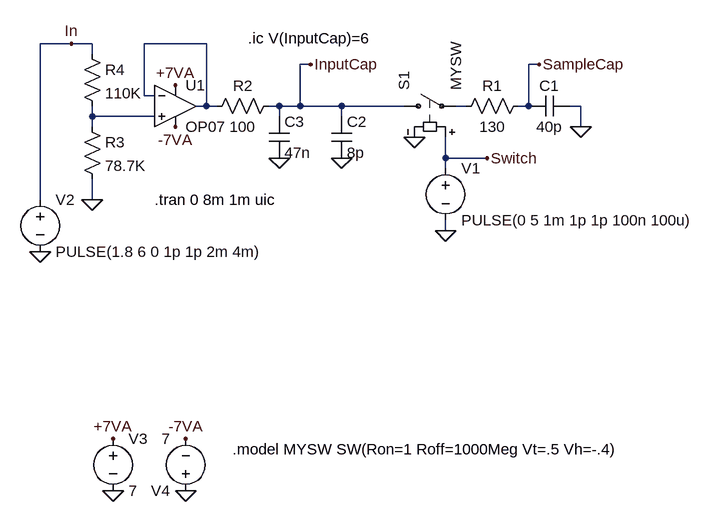
[diagram p0: schematic ADCInputSYM_withAMP2.asc]
ADCInputSYM_withAMP2.asc, the LTspice schematic file:
Version 4
SHEET 1 880 804
WIRE -368 96 -416 96
WIRE -336 96 -368 96
WIRE -160 96 -256 96
WIRE -336 112 -336 96
WIRE 0 128 -16 128
WIRE 352 128 336 128
WIRE -256 176 -256 96
WIRE -240 176 -256 176
WIRE -160 192 -160 96
WIRE -160 192 -176 192
WIRE -144 192 -160 192
WIRE -48 192 -64 192
WIRE -16 192 -16 128
WIRE -16 192 -48 192
WIRE 48 192 -16 192
WIRE 144 192 48 192
WIRE 240 192 224 192
WIRE 336 192 336 128
WIRE 336 192 320 192
WIRE 416 192 400 192
WIRE -336 208 -336 192
WIRE -240 208 -336 208
WIRE -48 208 -48 192
WIRE 48 208 48 192
WIRE -336 224 -336 208
WIRE 416 224 416 192
WIRE 208 272 208 240
WIRE 272 272 208 272
WIRE 208 288 208 272
WIRE -416 336 -416 96
WIRE -336 336 -336 304
WIRE 208 384 208 368
FLAG 48 272 0
FLAG -48 272 0
FLAG 160 240 0
FLAG 208 384 0
FLAG 416 224 0
FLAG -336 336 0
FLAG -416 416 0
FLAG 0 128 InputCap
FLAG -304 784 0
FLAG -192 784 0
FLAG 272 272 Switch
FLAG 352 128 SampleCap
FLAG -304 704 +7VA
FLAG -208 160 +7VA
FLAG -192 704 -7VA
FLAG -208 224 -7VA
FLAG -368 96 In
SYMBOL res 336 176 R90
WINDOW 0 0 56 VBottom 2
WINDOW 3 32 56 VTop 2
SYMATTR InstName R1
SYMATTR Value 130
SYMBOL cap 400 176 R90
WINDOW 0 0 32 VBottom 2
WINDOW 3 32 32 VTop 2
SYMATTR InstName C1
SYMATTR Value 40p
SYMBOL sw 128 192 R270
SYMATTR InstName S1
SYMATTR Value MYSW
SYMBOL cap 32 208 R0
SYMATTR InstName C2
SYMATTR Value 8p
SYMBOL cap -64 208 R0
SYMATTR InstName C3
SYMATTR Value 47n
SYMBOL res -48 176 R90
WINDOW 0 0 56 VBottom 2
WINDOW 3 32 56 VTop 2
SYMATTR InstName R2
SYMATTR Value 100
SYMBOL res -352 208 R0
SYMATTR InstName R3
SYMATTR Value 78.7K
SYMBOL res -352 96 R0
SYMATTR InstName R4
SYMATTR Value 110K
SYMBOL voltage 208 272 R0
WINDOW 123 0 0 Left 2
WINDOW 39 0 0 Left 2
SYMATTR InstName V1
SYMATTR Value PULSE(0 5 1m 1p 1p 100n 100u)
SYMBOL voltage -416 320 R0
WINDOW 123 0 0 Left 2
WINDOW 39 0 0 Left 2
SYMATTR InstName V2
SYMATTR Value PULSE(1.8 6 0 1p 1p 2m 4m)
SYMBOL Opamps\\OP07 -208 128 R0
SYMATTR InstName U1
SYMBOL voltage -304 688 R0
WINDOW 123 0 0 Left 2
WINDOW 39 0 0 Left 2
SYMATTR InstName V3
SYMATTR Value 7
SYMBOL voltage -192 800 R180
WINDOW 123 0 0 Left 2
WINDOW 39 0 0 Left 2
SYMATTR InstName V4
SYMATTR Value 7
TEXT -240 336 Left 2 !.tran 0 8m 1m uic
TEXT -120 720 Left 2 !.model MYSW SW(Ron=1 Roff=1000Meg Vt=.5 Vh=-.4)
TEXT -96 88 Left 2 !.ic V(InputCap)=6

The netlist it stands for:
* ADCInputSYM_withAMP2.asc
R1 SampleCap N002 130
C1 0 SampleCap 40p
S1 InputCap N002 Switch 0 MYSW
C2 InputCap 0 8p
C3 InputCap 0 47n
R2 InputCap N001 100
R3 N003 0 78.7K
R4 In N003 110K
V1 Switch 0 PULSE(0 5 1m 1p 1p 100n 100u)
V2 In 0 PULSE(1.8 6 0 1p 1p 2m 4m)
XU1 N003 N001 +7VA -7VA N001 LT1001  ; OP07, pins In+ In- V+ V- OUT
V3 +7VA 0 7
V4 0 -7VA 7
.tran 0 8m 1m uic
.model MYSW SW(Ron=1 Roff=1000Meg Vt=.5 Vh=-.4)
.ic V(InputCap)=6
.lib LTC.lib
.backanno
.end

* Results of the author's LTspice run, read from the files saved beside the schematic
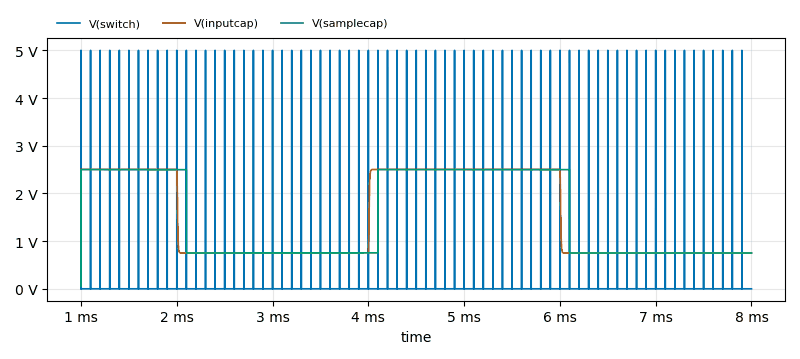
[diagram p1: Transient Analysis of ADCInputSYM_withAMP2.asc, plotted from the saved traces]
* Transient Analysis, 1 run:
*   V(switch): min 0 V, max 5 V, average 5 mV, rms 158.1 mV, last 0 V
*   V(inputcap): min 750.7 mV, max 2.502 V, average 1.504 V, rms 1.735 V, last 750.7 mV
*   V(samplecap): min 62.16 mV, max 2.502 V, average 1.526 V, rms 1.757 V, last 750.7 mV